# EAGLE design MoonlightHub (EAGLE 6.1)
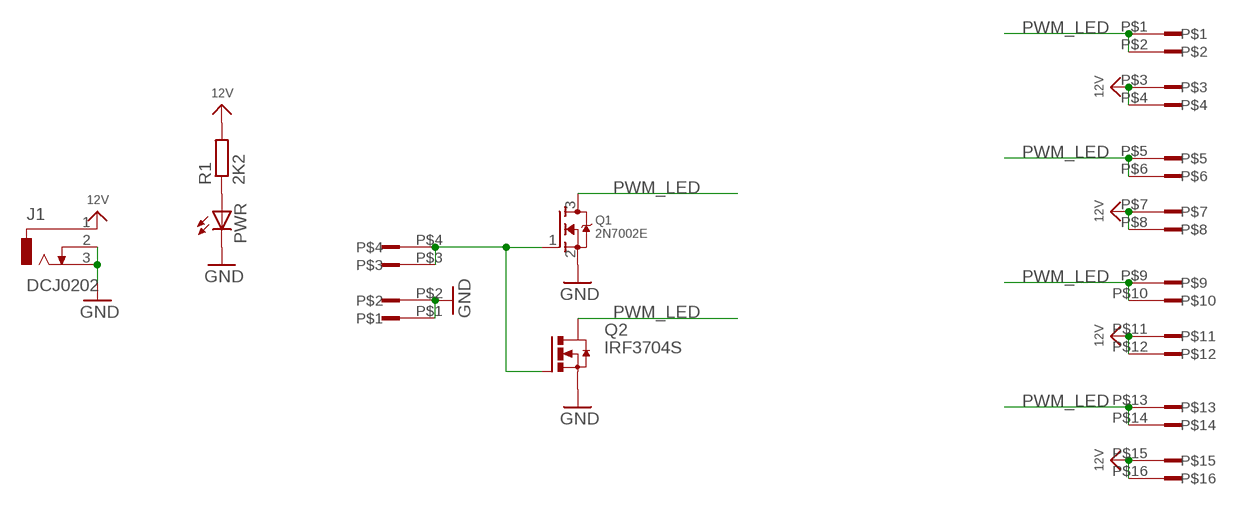
[diagram p0: schematic, sheet 1]

## Parts
CON1  CONN2  [CONN2]
CON2  CONN8  [CONN8]
J1  DCJ0202  [DCJ0202]
PWR  LED3MM  [LED3MM]
Q1  2N7002E  MOSFET-NWAVE  [SOT23-W]
Q2  IRF3704S  [D2PACK]
R1  2K2  R-EU_R0805W  [R0805W]

## Nets
12V: CON2.P$3 CON2.P$4 CON2.P$7 CON2.P$8 CON2.P$11 CON2.P$12 CON2.P$15 CON2.P$16 J1.1 R1.2
GND [gnd]: CON1.P$1 CON1.P$2 J1.2 J1.3 PWR.K(C) Q1.2(S) Q2.3(S)
N$2 [gnd]: CON1.P$3 CON1.P$4 Q1.1(G) Q2.1(G)
N$6: PWR.A R1.1
PWM_LED [gnd]: CON2.P$1 CON2.P$2 CON2.P$5 CON2.P$6 CON2.P$9 CON2.P$10 CON2.P$13 CON2.P$14 Q1.3(D) Q2.2(D)

## Library data of the parts
CON1 = con-screwless:CONN2
CON2 = con-screwless:CONN8
J1 = con-jack:DCJ0202: DC POWER JACK Source: DCJ0202.pdf; OC_FARNELL: unknown; OC_NEWARK: unknown
PWR = led:LED: LED OSRAM: - CHIPLED LG R971, LG N971, LY N971, LG Q971, LY Q971, LO R971, LY R971 LH N974, LH R974 LS Q976, LO Q976, LY Q976 LO Q996 - Hyper CHIPLED LW Q18S LB Q993, LB Q99A, LB R99A - SideLED LS A670, LO A670, LY A670, LG A670, LP A670 LB A673, LV A673, LT A673, LW A673 LH A674 LY A675 LS A676, LA A676, LO A676, LY A676, LW A676 LS A679, LY A679, LG A679 - Hyper Micro SIDELED® LS Y876, LA Y876, LO Y876, LY Y876 LT Y87S - SmartLED LW L88C, LW L88S LB L89C, LB L89S, LG L890 LS L89K, LO L89K, LY L89K LS L896, LA L896, LO L896, LY L896 - TOPLED LS T670, LO T670, LY T670, LG T670, LP T670 LSG T670, LSP T670, LSY T670, LOP T670, LYG T670 LG T671, LOG T671, LSG T671 LB T673, LV T673, LT T673, LW T673 LH T674 LS T676, LA T676, LO T676, LY T676, LB T676, LH T676, LSB T676, LW T676 LB T67C, LV T67C, LT T67C, LS T67K, LO T67K, LY T67K, LW E67C LS E67B, LA E67B, LO E67B, LY E67B, LB E67C, LV E67C, LT E67C LW T67C LS T679, LY T679, LG T679 LS T770, LO T770, LY T770, LG T770, LP T770 LB T773, LV T773, LT T773, LW T773 LH T774 LS E675, LA E675, LY E675, LS T675 LS T776, LA T776, LO T776, LY T776, LB T776 LHGB T686 LT T68C, LB T68C - Hyper Mini TOPLED® LB M676 - Mini TOPLED Santana® LG M470 LS M47K, LO M47K, LY M47K Source: http://www.osram.convergy.de LUXEON: - LUMILED® LXK2-PW12-R00, LXK2-PW12-S00, LXK2-PW14-U00, LXK2-PW14-V00 LXK2-PM12-R00, LXK2-PM12-S00, LXK2-PM14-U00 LXK2-PE12-Q00, LXK2-PE12-R00, LXK2-PE12-S00, LXK2-PE14-T00, LXK2-PE14-U00 LXK2-PB12-K00, LXK2-PB12-L00, LXK2-PB12-M00, LXK2-PB14-N00, LXK2-PB14-P00, LXK2-PB14-Q00 LXK2-PR12-L00, LXK2-PR12-M00, LXK2-PR14-Q00, LXK2-PR14-R00 LXK2-PD12-Q00, LXK2-PD12-R00, LXK2-PD12-S00 LXK2-PH12-R00, LXK2-PH12-S00 LXK2-PL12-P00, LXK2-PL12-Q00, LXK2-PL12-R00 Source: www.luxeon.com KINGBRIGHT: KA-3528ASYC Source: www.kingbright.com
Q1 = adafruit:MOSFET-N: N-Channel Mosfet 2N7002E - 60V 260mA SOT23 [Digikey: 2N7002ET1GOSTR-ND] - REEL BSH103 - 30V 850mA SOT23 [Digikey: 568-5013-1-ND]
Q2 = transistor-power:IRF3704: SMPS MOSFET HEXFET® Power MOSFET Source: http://www.irf.com/product-info/datasheets/data/irf3704.pdf
R1 = rcl:R-EU_: RESISTOR, European symbol

## Net classes
0 default: width 1.016 mm, drill 0.305 mm, clearance 0.508 mm
1 power: width 1.016 mm, drill 0.305 mm, clearance 0.508 mm
2 gnd: width 1.016 mm, drill 0.305 mm, clearance 0.508 mm

## Board
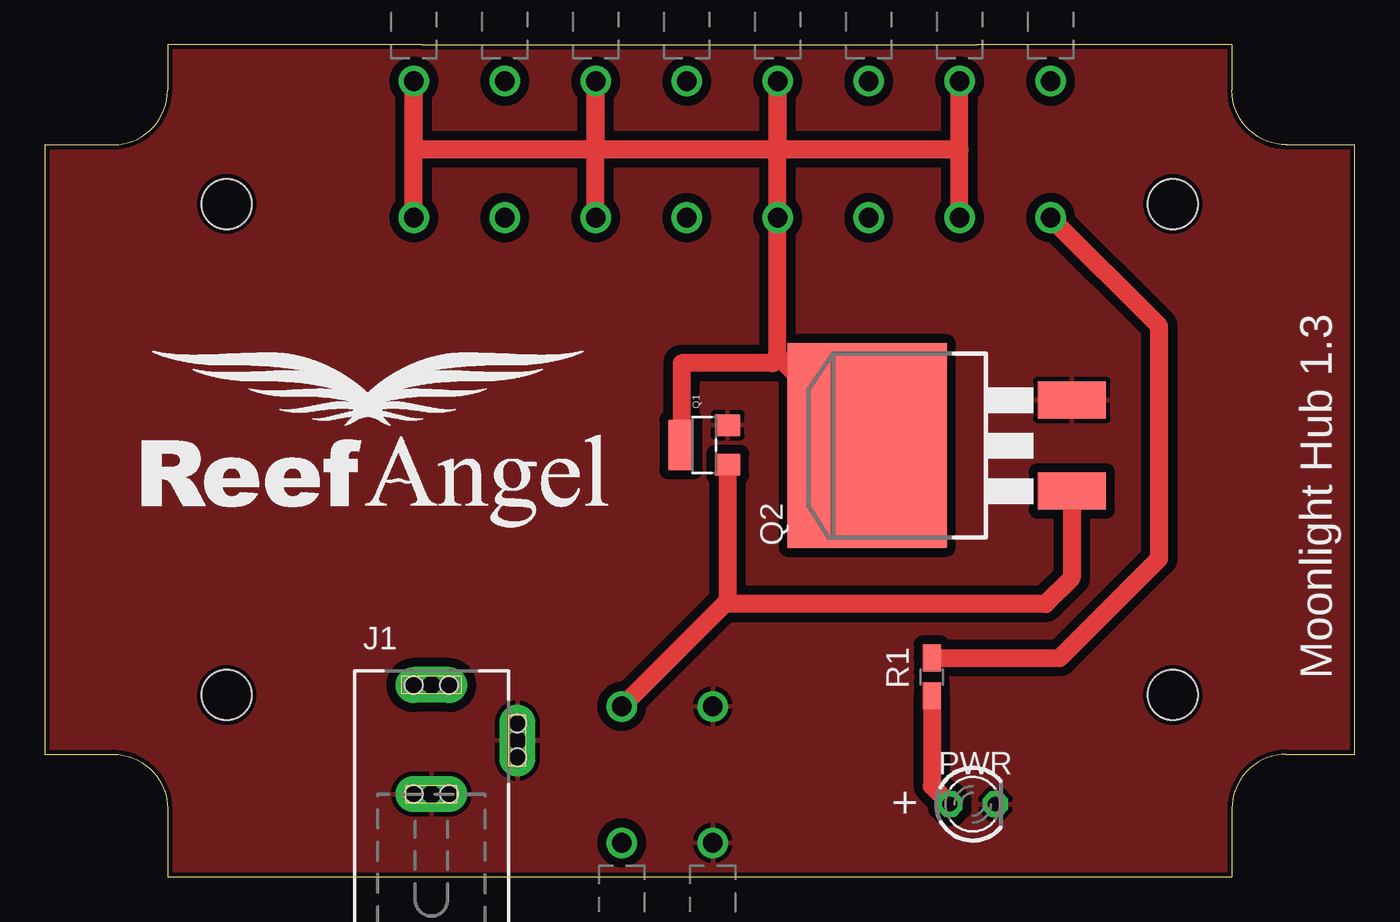
[diagram p1: board, top side]
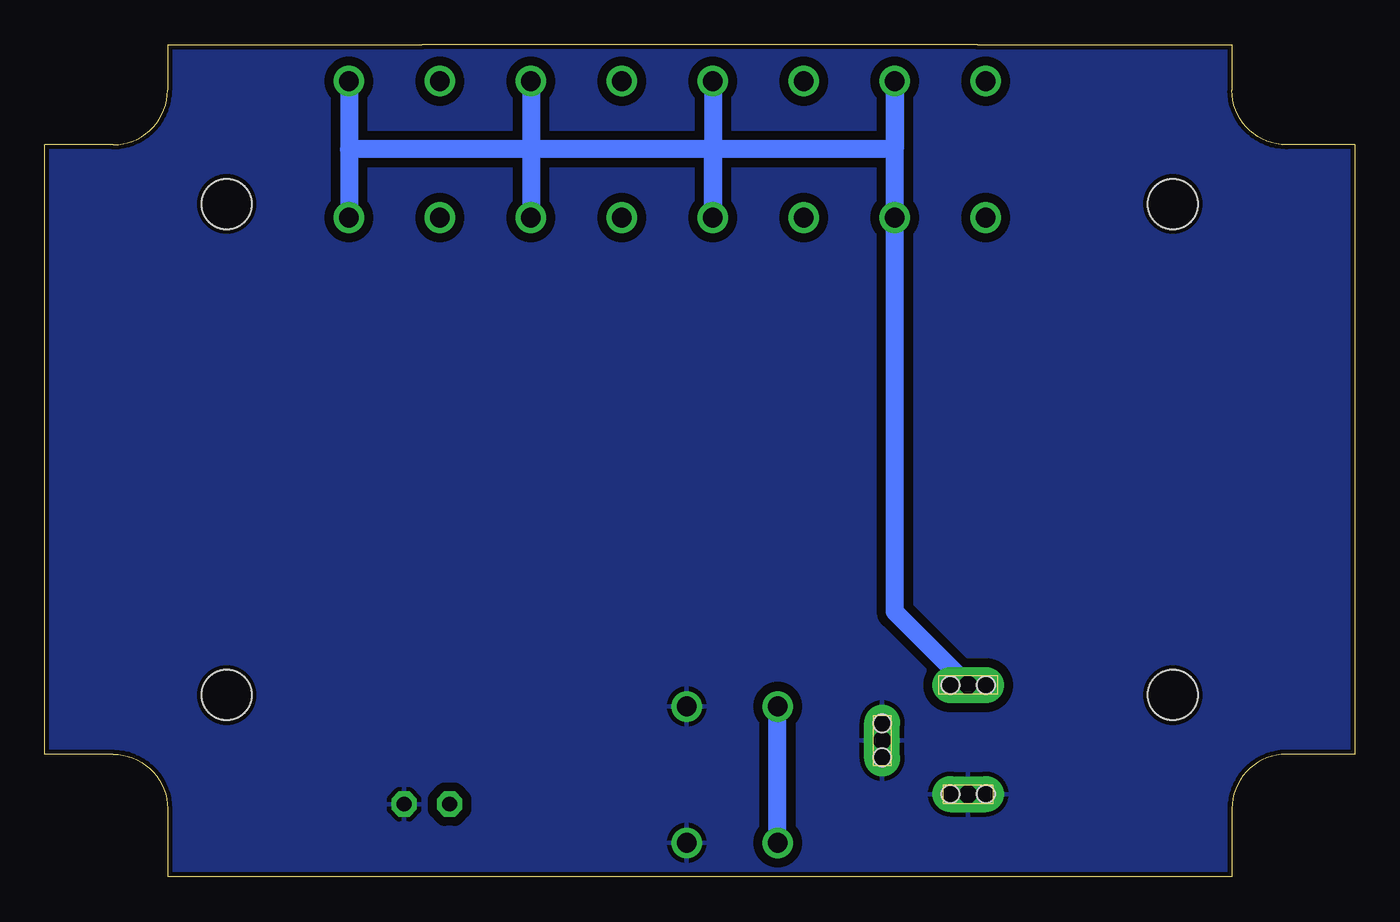
[diagram p2: board, bottom side, seen from below]

Size 73.15 x 46.48 mm. Coordinates in mm from the lower left corner, seen from the top.
Outline: 0,40.89 0,6.86 3.81,6.86 arc-90 6.86,3.81 6.86,0 66.29,0 66.29,3.81 arc-90 69.34,6.86 73.15,6.86 73.15,40.89 69.34,40.89 arc-90 66.29,43.94 66.29,46.48 52.07,46.48 21.08,46.48 6.86,46.48 6.86,43.94 arc-90 3.81,40.89 0,40.89
Copper layers (1*16): Top 0.035mm / dielectric 1.5mm / Bottom 0.035mm
Design rules: minimum track width 10mil, minimum drill 20mil, track to track 10mil, track to pad 10mil, pad to pad 10mil, via to via 10mil, smd to smd 10mil, copper to edge 10mil, drill to drill 10mil, minimum pad ring 12mil, minimum via ring 10mil, stop-mask expansion 4mil, vias tented up to drill 25mil, thermal gap 10mil
Holes 2.8 mm at 10.16,10.16 10.16,37.59 62.99,37.59 62.99,10.16

### Footprints (pad centres in the part's own frame; a part is rotated, then mirrored left to right if it is on the bottom)
CONN2 = drill 1.1: P$1 -0.73,0; P$2 -0.73,-7.62; P$3 4.35,0; P$4 4.35,-7.62
CONN8 = drill 1.1: P$1 -15.97,0; P$2 -15.97,-7.62; P$3 -10.89,0; P$4 -10.89,-7.62; P$5 -5.81,0; P$6 -5.81,-7.62; P$7 -0.73,0; P$8 -0.73,-7.62; P$9 4.35,0; P$10 4.35,-7.62; P$11 9.43,0; P$12 9.43,-7.62; P$13 14.51,0; P$14 14.51,-7.62; P$15 19.59,0; P$16 19.59,-7.62
DCJ0202 = drill 1 pad 2 long: 1 0,3.1; 2 4.8,0; 3 0,-3 | hole 1: 0.991,-2.997; -0.991,-2.997; 4.801,-0.94; 4.801,0.965; 0.991,3.099; -0.991,3.099
LED3MM = drill 0.813 octagon: A -1.27,0; K 1.27,0
SOT23-W = smd 1.2 x 1.4: 1 -1.1,-1.3; 2 1.1,-1.3 | smd 2.8 x 1.4: 3 0,1.3
D2PACK = smd 2.083 x 3.81: 1 -2.54,-8.89; 3 2.54,-8.89 | smd 11.43 x 8.89: 2 0,2.54
R0805W = smd 1.5 x 1: 1 -1.052,0; 2 1.052,0

### Placement (x,y rotation side)
CON1  36.58,1.91 180 top
CON2  36.58,44.45 0 top
J1  21.59,7.62 0 top
PWR  51.82,4.06 0 top
Q1  36.83,24.13 90 top
Q2  48.46,24.1 90 top
R1  49.53,11.18 90 top

### Tracks (layer width: path | path; a pad name or v marks a point on that pad's centre or on a via)
12V
  Top 1.016: R1.2 56.68,12.23 62.23,17.78 62.23,27.94 62.23,30.77 CON2.P$16
  Bottom 1.016: J1.1 25.69,14.82 CON2.P$4 CON2.P$3 25.69,40.64 35.85,40.64 | CON2.P$7 35.85,40.64 | 35.85,40.64 CON2.P$8 35.85,40.64 | 46.01,40.64 CON2.P$11 46.01,40.64 | 46.01,40.64 CON2.P$12 | CON2.P$15 56.17,40.64 | 56.17,40.64 CON2.P$16 | 46.01,40.64 56.17,40.64 | 35.85,40.64 46.01,40.64
GND
  pour Top (isolate 0.254): 0,0 73.66,0 73.66,46.99 0,46.99
  pour Bottom (isolate 0.254): 0,0 73.66,0 73.66,46.99 0,46.99
N$2
  Top 1.016: Q1.1 38.13,15.43 38.02,15.32 | 38.02,15.32 CON1.P$4 | Q2.1 57.35,16.71 55.88,15.24 38.1,15.24 38.02,15.32
  Bottom 1.016: CON1.P$3 CON1.P$4
N$6
  Top 1.016: R1.1 49.53,5.08 PWR.A
PWM_LED
  Top 1.016: CON2.P$2 CON2.P$1 20.61,40.64 30.77,40.64 | CON2.P$6 30.77,40.64 | 30.77,40.64 CON2.P$5 30.77,40.64 | 40.93,40.64 CON2.P$10 40.93,29.09 | 40.93,40.64 CON2.P$9 40.93,40.64 | CON2.P$14 51.09,40.64 | 51.09,40.64 CON2.P$13 | 30.77,40.64 40.93,40.64 | 40.93,40.64 51.09,40.64 | Q2.2 40.93,29.09 | Q1.3 35.56,24.13 35.56,28.7 40.64,28.7 40.93,29.09

### Text on the board
tPlace: Moonlight Hub 1.3
tNames: +